# Altium schematic sheet CFY01205V1.2.SchDoc
size A4
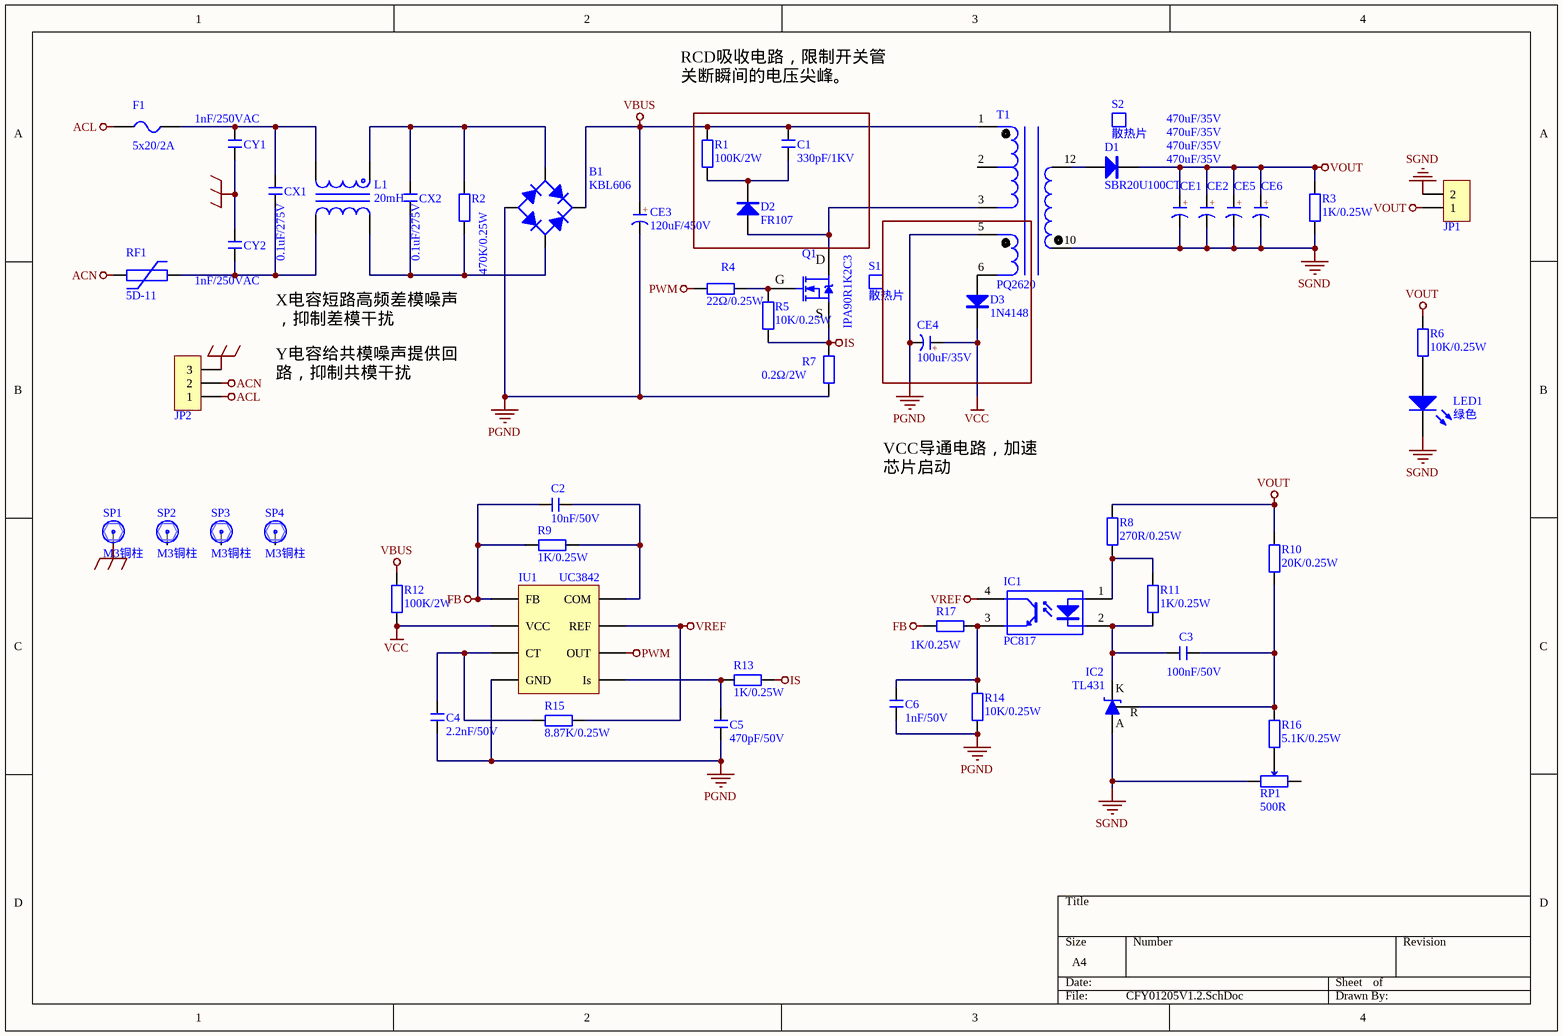
[diagram p0: CFY01205V1.2.SchDoc]

## Parts
B1  KBL606  [KBL]
C1  330pF/1KV  [CY 5*7*2.5]
C2  10nF/50V  [CC 2*5]
C3  100nF/50V  [CC 2*5]
C4  2.2nF/50V  [CC 2*5]
C5  470pF/50V  [CC 2*5]
C6  1nF/50V  [CC 2*5]
CE1  470uF/35V  [CAP 5.0*10*12.5]
CE2  470uF/35V  [CAP 5.0*10*12.5]
CE3  120uF/450V  [CAP 7.5*18*35.5]
CE4  100uF/35V  [CAP 2.5*6.3*11.2]
CE5  470uF/35V  [CAP 5.0*10*12.5]
CE6  470uF/35V  [CAP 5.0*10*12.5]
CX1  0.1uF/275V  [CX 10-13*11]
CX2  0.1uF/275V  [CX 10-13*11]
CY1  1nF/250VAC  [CY 7.5*8*4]
CY2  1nF/250VAC  [CY 7.5*8*4]
D1  SBR20U100CT  [TO220A]
D2  FR107  [DO-41]
D3  1N4148  [DO-35]
F1  5x20/2A  [FU 4x16_V]
IC1  PC817  [DIP4-300]
IC2  TL431  [TO92A]
IU1  UC3842  [DIP8-300]
JP1  HDR-1X2  [KF7620-2P]  (value not drawn)
JP2  HDR-1X3  [KF7620-3P]  (value not drawn)
L1  20mH  [UU10.5]
LED1  绿色  [LED 3MM-G]
Q1  IPA90R1K2C3  [TO220A]
R1  100K/2W  [RS 2W-V6]
R2  470K/0.25W  [RS 1/4W]
R3  1K/0.25W  [RS 1/4W]
R4  22Ω/0.25W  [RS 1/4W]
R5  10K/0.25W  [RS 1/4W]
R6  10K/0.25W  [RS 1/4W]
R7  0.2Ω/2W  [RS 2W-V6]
R8  270R/0.25W  [RS 1/4W]
R9  1K/0.25W  [RS 1/4W]
R10  20K/0.25W  [RS 1/4W]
R11  1K/0.25W  [RS 1/4W]
R12  100K/2W  [RS 2W-V6]
R13  1K/0.25W  [RS 1/4W]
R14  10K/0.25W  [RS 1/4W]
R15  8.87K/0.25W  [RS 1/4W]
R16  5.1K/0.25W  [RS 1/4W]
R17  1K/0.25W  [RS 1/4W]
RF1  5D-11  [TVR-10D]
RP1  500R  [3296W]
S1  散热片  [SRP16-24-25-P]
S2  散热片  [SRP16-24-25-P]
SP1  M3铜柱  [M3x4+6_N]
SP2  M3铜柱  [M3x4+6_N]
SP3  M3铜柱  [M3x4+6_N]
SP4  M3铜柱  [M3x4+6_N]
T1  PQ2620  [PQ2625+6PIN]

## Nets
ACL: F1.2 JP2.1
ACN: JP2.2 RF1.1
FB: C2.1 IU1.2(FB) R9.2 R17.1
IS: Q1.3(S) R5.1 R7.2 R13.1
PE: CY1.1 CY2.2 JP2.3 SP1.1
PGND: B1.DC- C4.2 C5.2 C6.1 CE3.2(K) CE4.2(K) IU1.5(GND) R7.1 R14.2 T1.5
PWM: IU1.6(OUT) R4.2
SGND: CE1.2(K) CE2.2(K) CE5.2(K) CE6.2(K) IC2.2(A) JP1.2 LED1.2(K) R3.2 RP1.1 T1.10
VBUS: B1.DC+ C1.1 CE3.1(A) R1.2 R12.1 T1.1
VCC: CE4.1(A) D3.2(K) IU1.7(VCC) R12.2
VOUT: CE1.1(A) CE2.1(A) CE5.1(A) CE6.1(A) D1.2(K) JP1.1 R3.1 R6.2 R8.1 R10.1
VREF: IC1.4(C) IU1.8(REF) R15.2
NetB1_AC1: B1.AC1 CX2.2 L1.1 R2.1
NetB1_AC2: B1.AC2 CX2.1 L1.4 R2.2
NetC1_2: C1.2 D2.2(K) R1.1
NetC2_2: C2.2 IU1.1(COM) R9.1
NetC3_1: C3.1 IC1.2(K) IC2.3(K) R11.2
NetC3_2: C3.2 IC2.1(R) R10.2 R16.1
NetC4_1: C4.1 IU1.4(CT) R15.1
NetC5_1: C5.1 IU1.3(Is) R13.2
NetC6_2: C6.2 IC1.3(E) R14.1 R17.2
NetCX1_1: CX1.1 CY2.1 L1.3 RF1.2
NetCX1_2: CX1.2 CY1.2 F1.1 L1.2
NetD1_1: D1.1(A) T1.12
NetD2_1: D2.1(A) Q1.2(D) T1.3
NetD3_1: D3.1(A) T1.6
NetIC1_1: IC1.1(A) R8.2 R11.1
NetLED1_1: LED1.1(A) R6.1
NetQ1_1: Q1.1(G) R4.1 R5.2
NetR16_2: R16.2 RP1.2

Not connected (* = marked no-connect by the designer): RP1 3; SP2 1; SP3 1; SP4 1; T1 2

## Notes on the sheet
- RCD吸收电路，限制开关管关断瞬间的电压尖峰。
- X电容短路高频差模噪声，抑制差模干扰
- Y电容给共模噪声提供回路，抑制共模干扰
- VCC导通电路，加速芯片启动
- (in symbol CE) +

## Library data of the parts
B1 = KBL: 600V/8A整流桥; BOM名称: 1KV/2A整流桥; 版权归属: 封装库来自淘宝卖家 ID：黄晶宝石; 学习资源: https://shop463601444.taobao.com
C1-C6 = CC: 瓷片电容; BOM名称: 直插瓷片电容; 淘宝ID: 封装库来自淘宝 ID：黄晶宝石; 封装库来自淘宝卖家 ID：黄晶宝石: 其他店铺购入均为盗版，不享受售后技术支持服务，请立即申请退款; 联系售后: https://shop463601444.taobao.com
CE1-CE6 = CE: 直插电解电容; 淘宝ID: 封装库来自淘宝 ID：黄晶宝石; BOM名称: 直插电解电容; 联系售后: https://shop463601444.taobao.com
CX1 CX2 = CX: 安规X电容; BOM名称: X电容; 版权归属: 封装库来自淘宝 ID：黄晶宝石; 联系售后: https://shop463601444.taobao.com
CY1 CY2 = CY: 安规Y电容; BOM名称: 高压陶瓷电容，Y电容; 版权归属: 封装库来自淘宝 ID：黄晶宝石; 联系售后: https://shop463601444.taobao.com
D1-D3 = 1N4007: 整流二极管; 淘宝ID: 封装库来自淘宝 ID：黄晶宝石; 封装库来自淘宝卖家 ID：黄晶宝石: 其他店铺购入均为盗版，不享受售后技术支持服务，请立即申请退款; BOM名称: 整流二极管; 联系售后，技术支持: https://shop463601444.taobao.com
F1 = FU DIP: 直插保险丝; 版权归属: 封装库来自淘宝卖家 ID：黄晶宝石; BOM名称: 直插保险丝; 学习资源: https://shop463601444.taobao.com
IC1 = 817: 线性光耦; 版权归属: 封装库来自淘宝 ID：黄晶宝石; BOM名称: 线性光耦; 学习资源: https://shop463601444.taobao.com
IC2 = TL431-ID: 可调基准稳压芯片; 版权归属: 封装库来自淘宝 ID：黄晶宝石; BOM名称: 可调基准稳压芯片; 学习资源: https://shop463601444.taobao.com
JP1 = Header 2: 2P接插件; 版权归属: 封装库来自淘宝 ID：黄晶宝石; BOM名称: 2P接插件; 技术支持，联系售后: https://shop463601444.taobao.com
JP2 = Header 3: 3P接插件; 版权归属: 封装库来自淘宝 ID：黄晶宝石; BOM名称: 3P接插件; 学习资源: https://shop463601444.taobao.com
L1 = L-UU: 共模电感; 版权归属: 封装库来自淘宝 ID：黄晶宝石; BOM名称: 共模电感; 联系售后: https://shop463601444.taobao.com
LED1 = LED-3MM: 直插3mm LED; BOM名称: 插件LED; 版权归属: 封装库来自淘宝 ID：黄晶宝石; 联系售后: https://shop463601444.taobao.com
Q1 = IRF840: N沟场效应管; BOM名称: N沟场效应管; 技术支持，联系售后: https://shop463601444.taobao.com
R1-R17 = R-S: 色环电阻; 版权归属: 封装库来自淘宝 ID：黄晶宝石; BOM名称: 色环电阻; 联系售后: https://shop463601444.taobao.com
RF1 = PPTC: PPTC自恢复保险丝; 版权归属: 封装库来自淘宝卖家 ID：黄晶宝石; BOM名称: PPTC自恢复保险丝; 学习资源: https://shop463601444.taobao.com
RP1 = RP: 单联电位器; BOM名称: 插件电位器; 版权归属: 封装库来自淘宝 ID：黄晶宝石; 联系售后: https://shop463601444.taobao.com
S1 S2 = S1: 版权归属: 封装库来自淘宝 ID：黄晶宝石; BOM名称: 散热片; 学习资源: https://shop463601444.taobao.com
SP1-SP4 = 铜柱加头大焊盘: 铜柱; 版权归属: 封装库来自淘宝 ID：黄晶宝石; BOM名称: 铜柱; 学习资源: https://shop463601444.taobao.com
T1 = PQ2620: 12V 高频变压器; 学习资源: 封装库来自淘宝卖家 ID：黄晶宝石; ROM名称: 12V 高频变压器; 版权归属: https://shop463601444.taobao.com
IU1 = UC3842: 其他唯一出售店铺网址: https://shop463601444.taobao.com